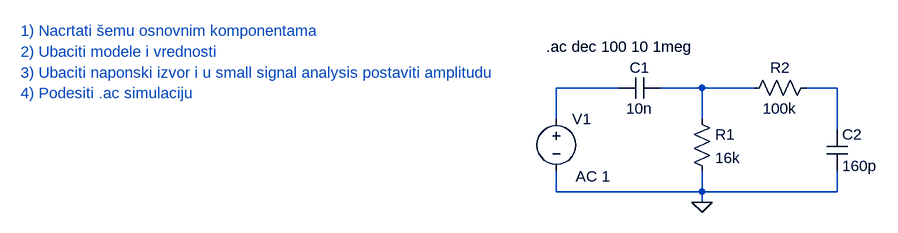
[diagram p0: schematic V6_BANDPASS.asc]
V6_BANDPASS.asc, the LTspice schematic file:
Version 4
SHEET 1 880 680
WIRE -16 128 -112 128
WIRE 112 128 48 128
WIRE 192 128 112 128
WIRE 320 128 272 128
WIRE -112 176 -112 128
WIRE 112 176 112 128
WIRE 320 192 320 128
WIRE -112 288 -112 256
WIRE 112 288 112 256
WIRE 112 288 -112 288
WIRE 320 288 320 256
WIRE 320 288 112 288
WIRE 112 304 112 288
FLAG 112 304 0
SYMBOL voltage -112 160 R0
WINDOW 123 30 104 Left 2
WINDOW 39 0 0 Left 0
SYMATTR Value2 AC 1
SYMATTR InstName V1
SYMATTR Value ""
SYMBOL cap 48 112 R90
WINDOW 0 0 32 VBottom 2
WINDOW 3 32 32 VTop 2
SYMATTR InstName C1
SYMATTR Value 10n
SYMBOL res 96 160 R0
SYMATTR InstName R1
SYMATTR Value 16k
SYMBOL res 288 112 R90
WINDOW 0 0 56 VBottom 2
WINDOW 3 32 56 VTop 2
SYMATTR InstName R2
SYMATTR Value 100k
SYMBOL cap 304 192 R0
SYMATTR InstName C2
SYMATTR Value 160p
TEXT -936 40 Left 2 ;1) Nacrtati šemu osnovnim komponentama
TEXT -936 72 Left 2 ;2) Ubaciti modele i vrednosti
TEXT -128 64 Left 2 !.ac dec 100 10 1meg
TEXT -936 104 Left 2 ;3) Ubaciti naponski izvor i u small signal analysis postaviti amplitudu
TEXT -936 136 Left 2 ;4) Podesiti .ac simulaciju

The netlist it stands for:
* V6_BANDPASS.asc
V1 N001 0 AC 1
C1 N002 N001 10n
R1 N002 0 16k
R2 N003 N002 100k
C2 N003 0 160p
* 1) Nacrtati šemu osnovnim komponentama
* 2) Ubaciti modele i vrednosti
.ac dec 100 10 1meg
* 3) Ubaciti naponski izvor i u small signal analysis postaviti amplitudu
* 4) Podesiti .ac simulaciju
.backanno
.end